# Altium schematic sheet MB1936_Project_Overview.SchDoc: Project overview
size A4; Date: Not used; ApprovedBy: Not used; CheckedBy: Not used; Author: Not used; CompanyName: STMicroelectronics; DrawnBy: Not used; Engineer: Not used; Organization: Not used; Address1: Not used; Address2: Not used; Address3: Not used; Address4: Not used; DocumentNumber: Not used; Revision: Not used; SheetNumber: 1; SheetTotal: 18; CurrentTime: Not used; CurrentDate: Not used; Time: Not used; DocumentFullPathAndName: Not used; DocumentName: Not used; ModifiedDate: Not used; ImagePath: Not used; ProjectName: Not used; Application_BuildNumber: Not used
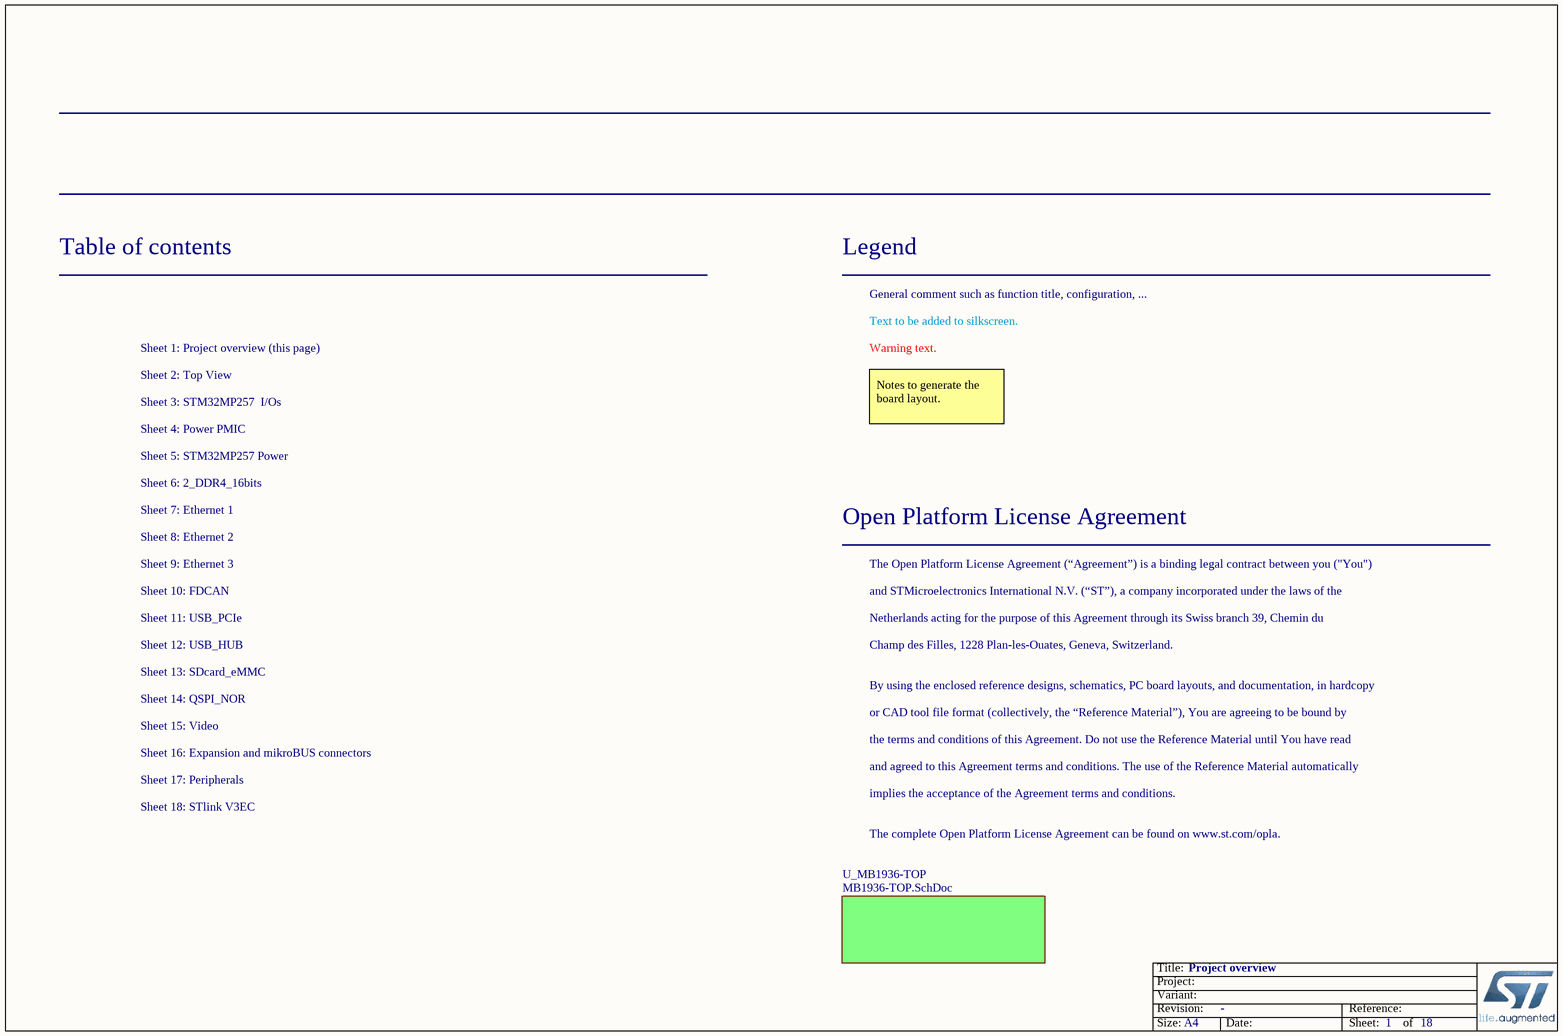
[diagram p0: MB1936_Project_Overview.SchDoc]

## Sub-sheets
U_MB1936-TOP = MB1936-TOP.SchDoc: no entries

## Notes on the sheet
- Table of contents
- Legend
- General comment such as function title, configuration, ...
- Sheet 1: Project overview (this page)
- Sheet 2: Top View
- Text to be added to silkscreen.
- Warning text.
- Sheet 3: STM32MP257  I/Os
- Sheet 4: Power PMIC
- Notes to generate the board layout.
- Sheet 5: STM32MP257 Power
- Sheet 7: Ethernet 1
- Sheet 6: 2_DDR4_16bits
- Sheet 8: Ethernet 2
- Sheet 9: Ethernet 3
- Open Platform License Agreement
- The Open Platform License Agreement (“Agreement”) is a binding legal contract between you ("You")
- Sheet 10: FDCAN
- Sheet 11: USB_PCIe
- Sheet 12: USB_HUB
- and STMicroelectronics International N.V. (“ST”), a company incorporated under the laws of the
- Netherlands acting for the purpose of this Agreement through its Swiss branch 39, Chemin du
- Champ des Filles, 1228 Plan-les-Ouates, Geneva, Switzerland.
- Sheet 13: SDcard_eMMC
- Sheet 14: QSPI_NOR
- By using the enclosed reference designs, schematics, PC board layouts, and documentation, in hardcopy
- or CAD tool file format (collectively, the “Reference Material”), You are agreeing to be bound by
- Sheet 17: Peripherals
- Sheet 16: Expansion and mikroBUS connectors
- Sheet 15: Video
- the terms and conditions of this Agreement. Do not use the Reference Material until You have read
- and agreed to this Agreement terms and conditions. The use of the Reference Material automatically
- Sheet 18: STlink V3EC
- implies the acceptance of the Agreement terms and conditions.
- The complete Open Platform License Agreement can be found on www.st.com/opla.
- Title:
- Project:
- Size:
- Revision:
- Variant:
- A4
- -
- Date:
- Reference:
- Sheet:
- of